# EAGLE schematic non_inv_high_pass_filter (EAGLE 9.6.2)
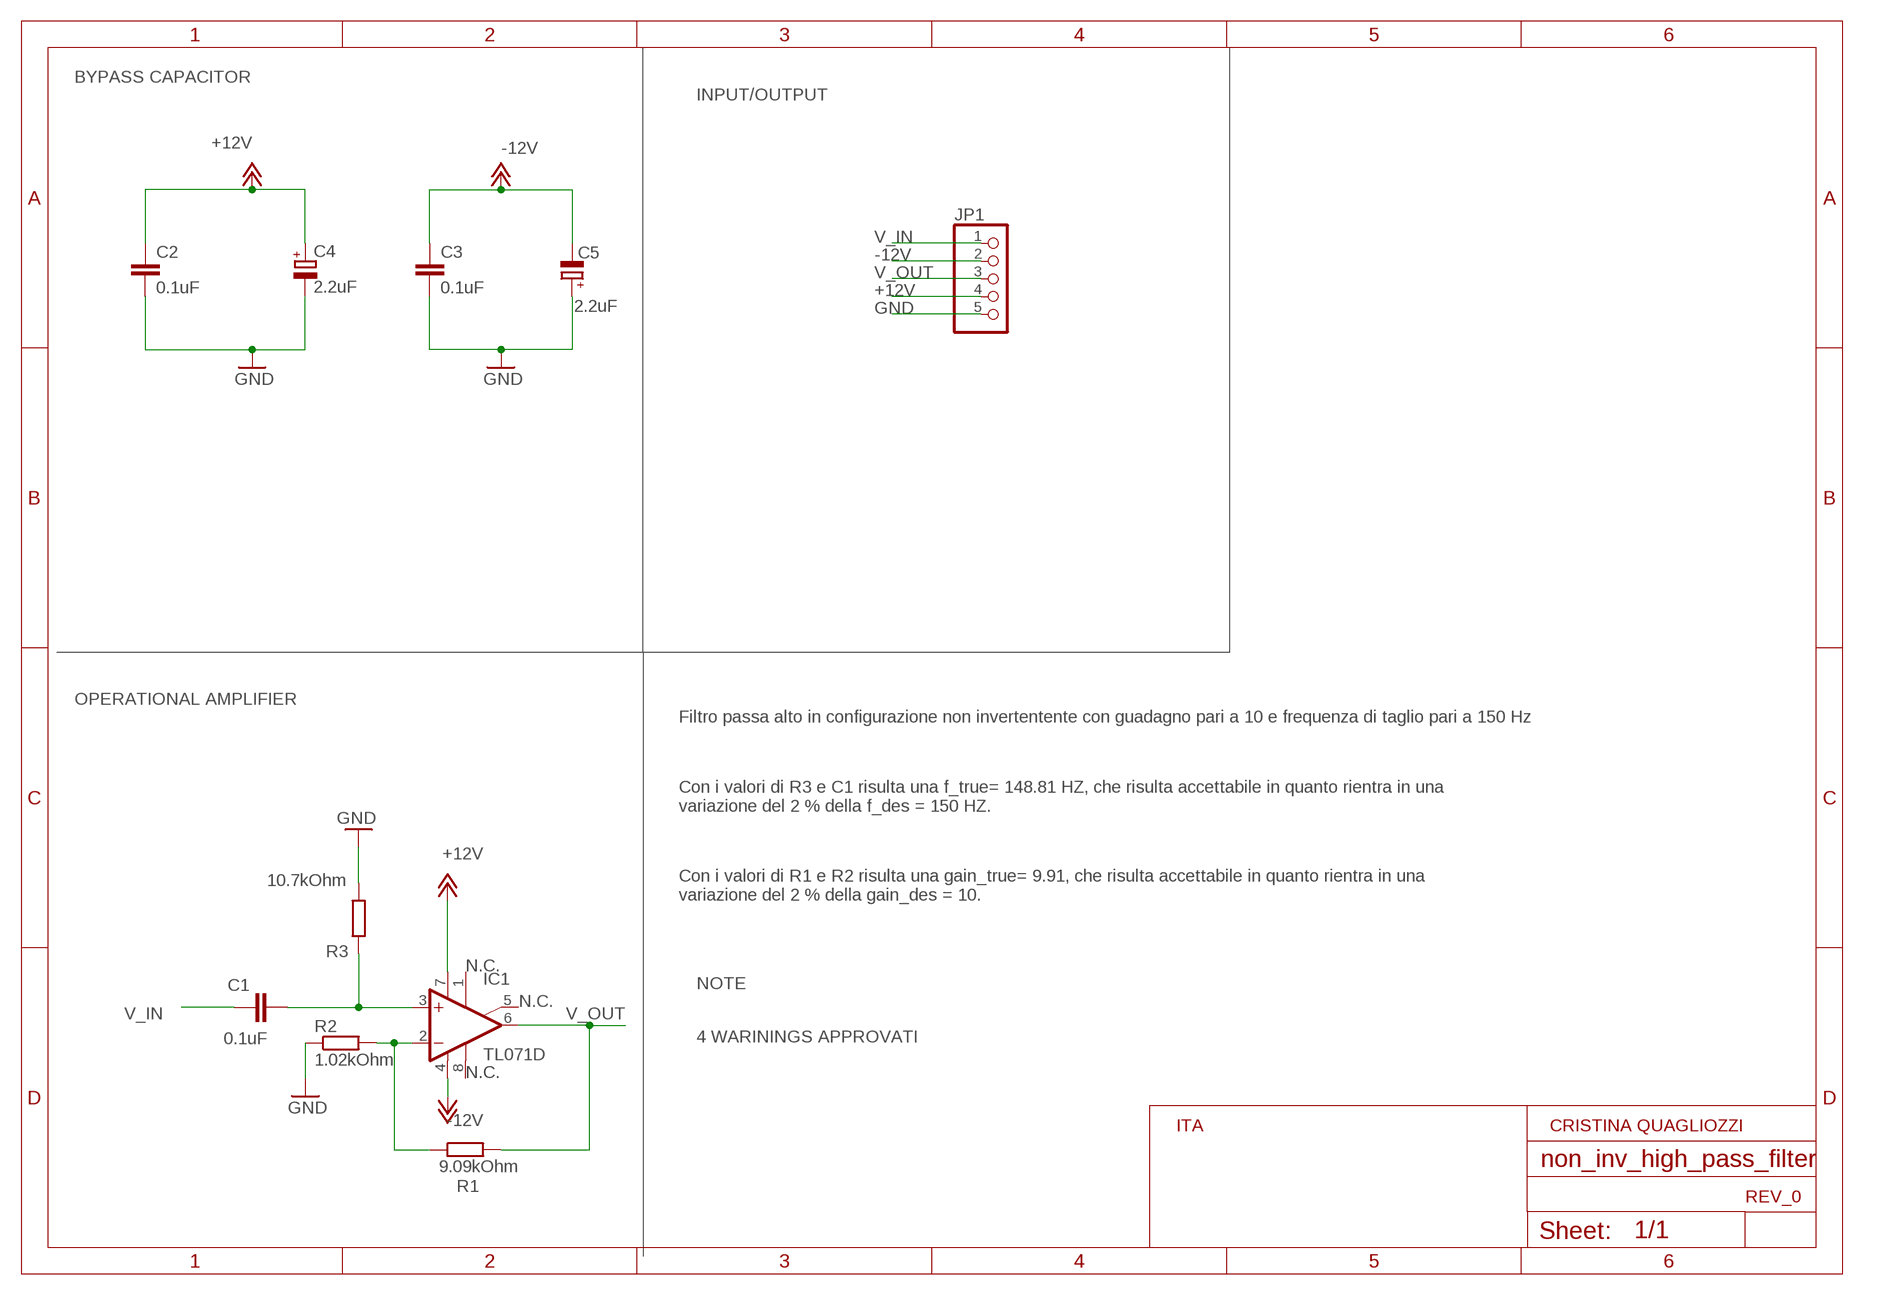
[diagram p0: schematic, sheet 1]

## Parts
C1  0.1uF  C-EUC0603  [C0603]
C2  0.1uF  C-EUC0603  [C0603]
C3  0.1uF  C-EUC0603  [C0603]
C4  2.2uF  CPOL-EUA/3216-18R  [A/3216-18R]
C5  2.2uF  CPOL-EUA/3216-18R  [A/3216-18R]
IC1  TL071D  [SO08]
JP1  PINHD-1X5  [1X05]
R1  9.09kOhm  R-EU_R0603  [R0603]
R2  1.02kOhm  R-EU_R0603  [R0603]
R3  10.7kOhm  R-EU_R0603  [R0603]

## Nets
+12V: C2.1 C4.+ IC1.7(V+) JP1.4
-12V: C3.1 C5.- IC1.4(V-) JP1.2
GND: C2.2 C3.2 C4.- C5.+ JP1.5 R2.1 R3.2
N$1: C1.2 IC1.3(+IN) R3.1
N$4: IC1.2(-IN) R1.1 R2.2
V_IN: C1.1 JP1.1
V_OUT: IC1.6(OUT) JP1.3 R1.2
Unconnected: IC1.1(ON1) IC1.5(ON2) IC1.8(OPT)

## Notes on the sheet
- BYPASS CAPACITOR
- INPUT/OUTPUT
- OPERATIONAL AMPLIFIER
- Filtro passa alto in configurazione non invertentente con guadagno pari a 10 e frequenza di taglio pari a 150 Hz
- Con i valori di R3 e C1 risulta una f_true= 148.81 HZ, che risulta accettabile in quanto rientra in una
  variazione del 2 % della f_des = 150 HZ.
- Con i valori di R1 e R2 risulta una gain_true= 9.91, che risulta accettabile in quanto rientra in una
  variazione del 2 % della gain_des = 10.
- N.C.
- NOTE
- N.C.
- 4 WARININGS APPROVATI
- N.C.
- ITA | CRISTINA QUAGLIOZZI
- REV_0

## Library data of the parts
C1-C3 = rcl:C-EU: CAPACITOR, European symbol; MF: KYOCERA AVX; MPN: 0603YC104KAT2A; OC_FARNELL: 1327679; SPICEPREFIX: C
C4 C5 = rcl:CPOL-EU: POLARIZED CAPACITOR, European symbol; MF: KEMET; MPN: T491A225K016AT; OC_FARNELL: 1457418; SPICEPREFIX: C
IC1 = linear:TL071: OP AMP; MF: STMICROELECTRONICS; MPN: TL071IDT; OC_FARNELL: 3130164
JP1 = pinhead:PINHD-1X5: PIN HEADER; MF: MOLEX; MPN: 90120-0765; OC_FARNELL: 1756964
R1 = rcl:R-EU_: RESISTOR, European symbol; MF: VISHAY; MPN: CRCW06039K09FKEA.; OC_FARNELL: 2138421; SPICEPREFIX: R
R2 = rcl:R-EU_: RESISTOR, European symbol; MF: MULTICOMP PRO; MPN: MCWR06X1021FTL; OC_FARNELL: 2694687; SPICEPREFIX: R
R3 = rcl:R-EU_: RESISTOR, European symbol; MF: PANASONIC; MPN: ERJPA3F1072V; OC_FARNELL: 2561732; SPICEPREFIX: R